# EAGLE schematic PowerLineSwtich (EAGLE 8.1.1)

## Sheet 1 of 3
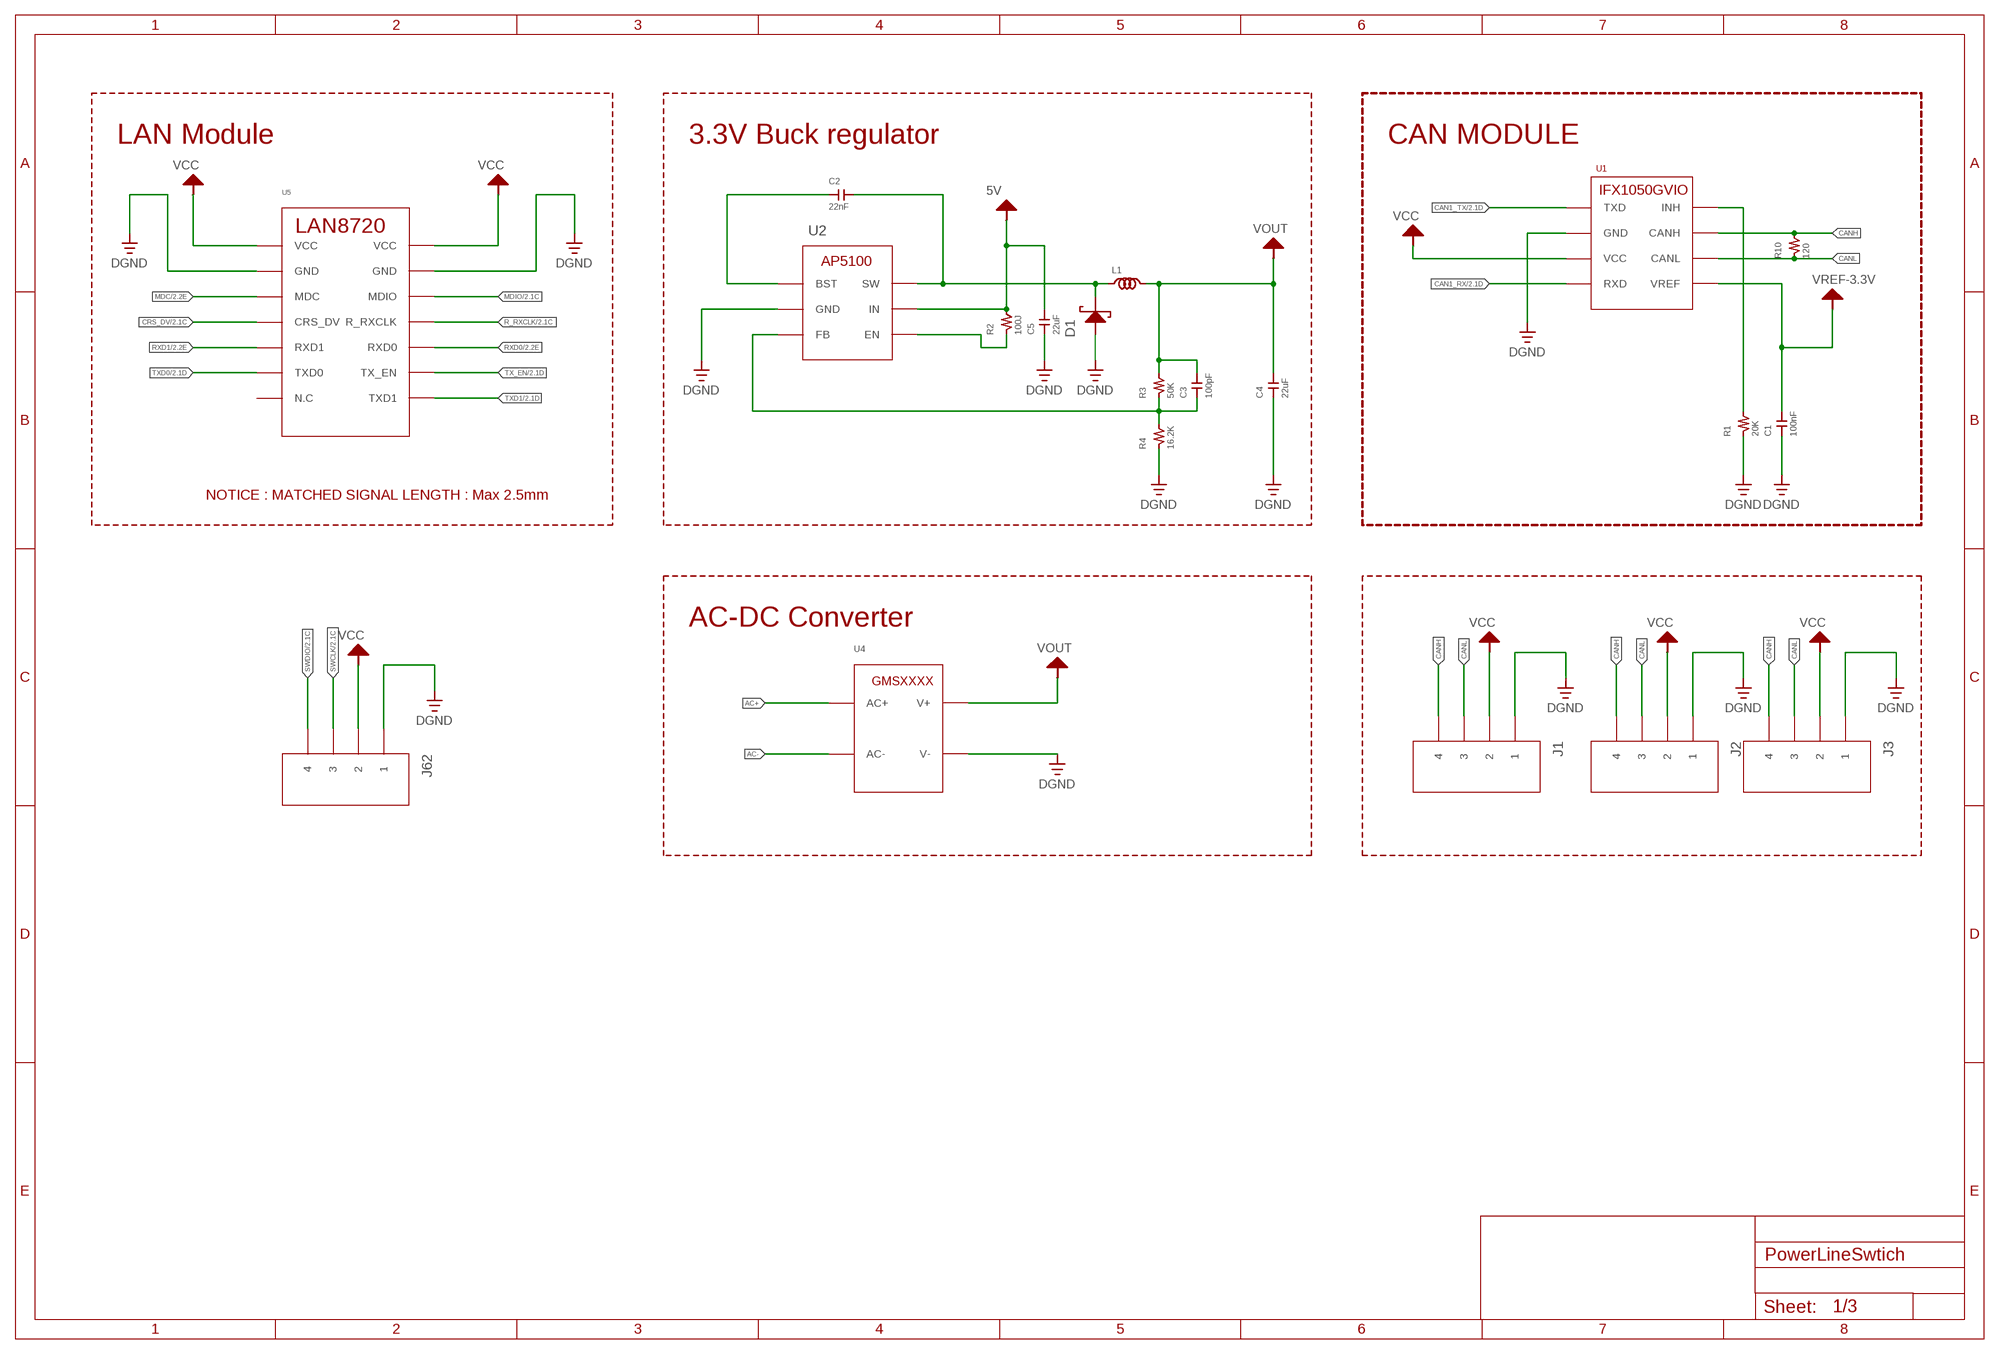
[diagram p0: schematic, sheet 1]

### Parts
C1  100nF  CAPACITOR_CHIP2012  [2012]
C2  22nF  CAPACITOR_CHIP2012  [2012]
C3  100pF  CAPACITOR_CHIP2012  [2012]
C4  22uF  CAPACITOR_CHIP2012  [2012]
C5  22uF  CAPACITOR_CHIP2012  [2012]
D1  BAT60JFILM  [SOD323]
J1  4PIN_2.54  [4PIN]
J2  4PIN_2.54  [4PIN]
J3  4PIN_2.54  [4PIN]
J62  4PIN_2.54  [4PIN]
L1  INDUCTOR2012  [2012]
R1  20K  RESISTOR_CHIP_2012  [2012]
R2  100J  RESISTOR_CHIP_2012  [2012]
R3  50K  RESISTOR_CHIP_2012  [2012]
R4  16.2K  RESISTOR_CHIP_2012  [2012]
R10  120  RESISTOR_CHIP_2012  [2012]
U1  IFX1050GVIO  [PG-DSO-8]
U2  AP5100  [SOT-26]
U4  GMSXXXX  [GMSXXXX]
U5  LAN8720  [7X2]

### Nets
5V: C5.P$2 R2.P$2 U2.P5(IN) U4.P4(V+) ; supply symbol labelled VOUT
AC+: U4.P1(AC+)
AC-: U4.P2(AC-)
BST: C2.P$1 U2.P1(BST)
CAN1_RX: U1.P4(RXD) ; also sheet 2
CAN1_TX: U1.P1(TXD) ; also sheet 2
CANH: J1.P$4 J2.P$4 J3.P$4 R10.P$2 U1.P7(CANH)
CANL: J1.P$3 J2.P$3 J3.P$3 R10.P$1 U1.P6(CANL)
CRS_DV: U5.P7(CRS_DV) ; also sheet 2
DGND: C1.P$1 C4.P$1 C5.P$1 D1.A J1.P$1 J2.P$1 J3.P$1 J62.P$1 R1.P$1 R4.P$1 U1.P2(GND) U2.P2(GND) U4.P3(V-) U5.P3(GND) U5.P4(GND) ; also sheet 2,3
EN: R2.P$1 U2.P4(EN)
FB: C3.P$1 R3.P$1 R4.P$2 U2.P3(FB)
MDC: U5.P5(MDC) ; also sheet 2
MDIO: U5.P6(MDIO) ; also sheet 2
N$3: R1.P$2 U1.P8(INH)
R_RXCLK: U5.P8(R_RXCLK) ; also sheet 2
RXD0: U5.P10(RXD0) ; also sheet 2
RXD1: U5.P9(RXD1) ; also sheet 2
SW: C2.P$2 D1.K L1.P$1 U2.P6(SW)
SWCLK: J62.P$3 ; also sheet 2
SWDIO: J62.P$4 ; also sheet 2
TX_EN: U5.P12(TX_EN) ; also sheet 2
TXD0: U5.P11(TXD0) ; also sheet 2
TXD1: U5.P14(TXD1) ; also sheet 2
VCC: C1.P$2 J1.P$2 J2.P$2 J3.P$2 J62.P$2 U1.P3(VCC) U1.P5(VREF) U5.P1(VCC) U5.P2(VCC) ; supply symbol labelled VREF-3.3V ; also sheet 2
VOUT: C3.P$2 C4.P$2 L1.P$2 R3.P$2
Unconnected: U5.P13(N.C)

### Notes on the sheet
- LAN Module | 3.3V Buck regulator | CAN MODULE
- NOTICE : MATCHED SIGNAL LENGTH : Max 2.5mm
- AC-DC Converter

## Sheet 2 of 3
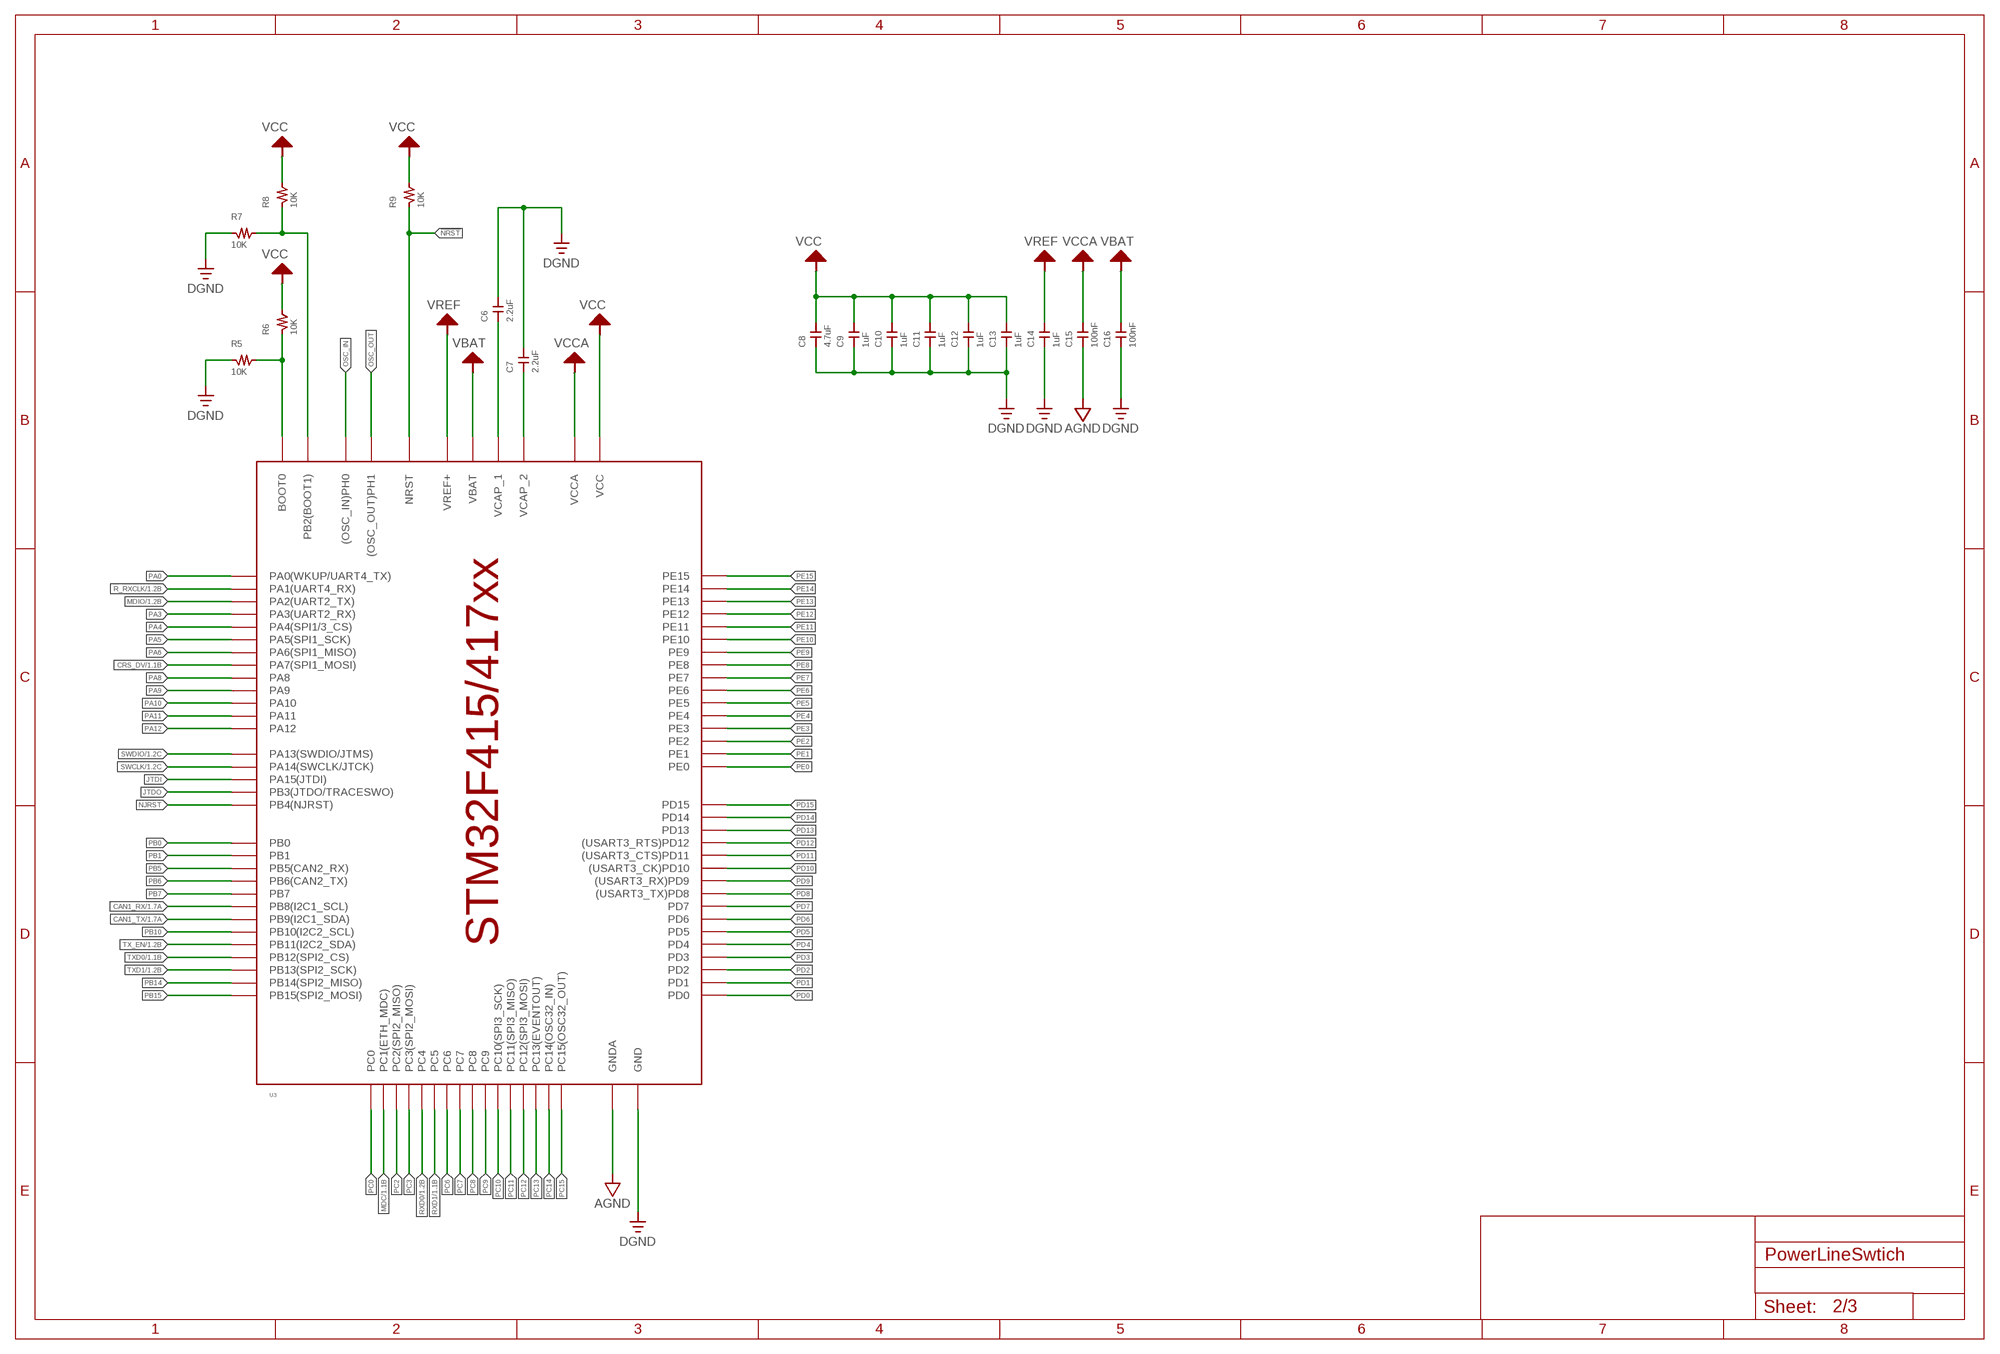
[diagram p1: schematic, sheet 2]

### Parts
C6  2.2uF  CAPACITOR_CHIP2012  [2012]
C7  2.2uF  CAPACITOR_CHIP2012  [2012]
C8  4.7uF  CAPACITOR_CHIP2012  [2012]
C9  1uF  CAPACITOR_CHIP2012  [2012]
C10  1uF  CAPACITOR_CHIP2012  [2012]
C11  1uF  CAPACITOR_CHIP2012  [2012]
C12  1uF  CAPACITOR_CHIP2012  [2012]
C13  1uF  CAPACITOR_CHIP2012  [2012]
C14  1uF  CAPACITOR_CHIP2012  [2012]
C15  100nF  CAPACITOR_CHIP2012  [2012]
C16  100nF  CAPACITOR_CHIP2012  [2012]
R5  10K  RESISTOR_CHIP_2012  [2012]
R6  10K  RESISTOR_CHIP_2012  [2012]
R7  10K  RESISTOR_CHIP_2012  [2012]
R8  10K  RESISTOR_CHIP_2012  [2012]
R9  10K  RESISTOR_CHIP_2012  [2012]
U3  STM32F415/417  [LQFP100]

### Nets
!NRST: R9.P$1 U3.P$14(NRST)
BOOT0: R5.P$2 R6.P$1 U3.P$94(BOOT0)
BOOT1: R7.P$2 R8.P$1 U3.P$37(PB2(BOOT1))
CAN1_RX: U3.P$95(PB8(I2C1_SCL)) ; also sheet 1
CAN1_TX: U3.P$96(PB9(I2C1_SDA)) ; also sheet 1
CRS_DV: U3.P$32(PA7(SPI1_MOSI)) ; also sheet 1
DGND: C6.P$2 C7.P$2 C8.P$1 C9.P$1 C10.P$1 C11.P$1 C12.P$1 C13.P$1 C14.P$1 C15.P$1 C16.P$1 R5.P$1 R7.P$1 U3.P$10(GND) U3.P$20(GNDA) U3.P$27(GND) U3.P$74(GND) U3.P$99(GND) ; supply symbol labelled AGND ; also sheet 1,3
JTDI: U3.P$77(PA15(JTDI))
JTDO: U3.P$89(PB3(JTDO/TRACESWO))
MDC: U3.P$16(PC1(ETH_MDC)) ; also sheet 1
MDIO: U3.P$25(PA2(UART2_TX)) ; also sheet 1
NJRST: U3.P$90(PB4(NJRST))
OSC_IN: U3.P$12((OSC_IN)PH0)
OSC_OUT: U3.P$13((OSC_OUT)PH1)
PA0: U3.P$23(PA0(WKUP/UART4_TX))
PA3: U3.P$26(PA3(UART2_RX))
PA4: U3.P$29(PA4(SPI1/3_CS))
PA5: U3.P$30(PA5(SPI1_SCK))
PA6: U3.P$31(PA6(SPI1_MISO))
PA8: U3.P$67(PA8)
PA9: U3.P$68(PA9)
PA10: U3.P$69(PA10)
PA11: U3.P$70(PA11)
PA12: U3.P$71(PA12)
PB0: U3.P$35(PB0)
PB1: U3.P$36(PB1)
PB5: U3.P$91(PB5(CAN2_RX))
PB6: U3.P$92(PB6(CAN2_TX))
PB7: U3.P$93(PB7)
PB10: U3.P$47(PB10(I2C2_SCL))
PB14: U3.P$53(PB14(SPI2_MISO))
PB15: U3.P$54(PB15(SPI2_MOSI))
PC0: U3.P$15(PC0)
PC2: U3.P$17(PC2(SPI2_MISO))
PC3: U3.P$18(PC3(SPI2_MOSI))
PC6: U3.P$63(PC6)
PC7: U3.P$64(PC7)
PC8: U3.P$65(PC8)
PC9: U3.P$66(PC9)
PC10: U3.P$78(PC10(SPI3_SCK))
PC11: U3.P$79(PC11(SPI3_MISO))
PC12: U3.P$80(PC12(SPI3_MOSI))
PC13: U3.P$7(PC13(EVENTOUT))
PC14: U3.P$8(PC14(OSC32_IN))
PC15: U3.P$9(PC15(OSC32_OUT))
PD0: U3.P$81(PD0)
PD1: U3.P$82(PD1)
PD2: U3.P$83(PD2)
PD3: U3.P$84(PD3)
PD4: U3.P$85(PD4)
PD5: U3.P$86(PD5)
PD6: U3.P$87(PD6)
PD7: U3.P$88(PD7)
PD8: U3.P$55((USART3_TX)PD8)
PD9: U3.P$56((USART3_RX)PD9)
PD10: U3.P$57((USART3_CK)PD10)
PD11: U3.P$58((USART3_CTS)PD11)
PD12: U3.P$59((USART3_RTS)PD12)
PD13: U3.P$60(PD13)
PD14: U3.P$61(PD14)
PD15: U3.P$62(PD15)
PE0: U3.P$97(PE0)
PE1: U3.P$98(PE1)
PE2: U3.P$1(PE2)
PE3: U3.P$2(PE3)
PE4: U3.P$3(PE4)
PE5: U3.P$4(PE5)
PE6: U3.P$5(PE6)
PE7: U3.P$38(PE7)
PE8: U3.P$39(PE8)
PE9: U3.P$40(PE9)
PE10: U3.P$41(PE10)
PE11: U3.P$42(PE11)
PE12: U3.P$43(PE12)
PE13: U3.P$44(PE13)
PE14: U3.P$45(PE14)
PE15: U3.P$46(PE15)
R_RXCLK: U3.P$24(PA1(UART4_RX)) ; also sheet 1
RXD0: U3.P$33(PC4) ; also sheet 1
RXD1: U3.P$34(PC5) ; also sheet 1
SWCLK: U3.P$76(PA14(SWCLK/JTCK)) ; also sheet 1
SWDIO: U3.P$72(PA13(SWDIO/JTMS)) ; also sheet 1
TX_EN: U3.P$48(PB11(I2C2_SDA)) ; also sheet 1
TXD0: U3.P$51(PB12(SPI2_CS)) ; also sheet 1
TXD1: U3.P$52(PB13(SPI2_SCK)) ; also sheet 1
VBAT: C16.P$2 U3.P$6(VBAT)
VCAP1: C6.P$1 U3.P$49(VCAP_1)
VCAP2: C7.P$1 U3.P$73(VCAP_2)
VCC: C8.P$2 C9.P$2 C10.P$2 C11.P$2 C12.P$2 C13.P$2 C15.P$2 R6.P$2 R8.P$2 R9.P$2 U3.P$11(VCC) U3.P$19(VCC) U3.P$22(VCCA) U3.P$28(VCC) U3.P$50(VCC) U3.P$75(VCC) U3.P$100(VCC) ; supply symbol labelled VCCA ; also sheet 1
VREF: C14.P$2 U3.P$21(VREF+)

## Sheet 3 of 3
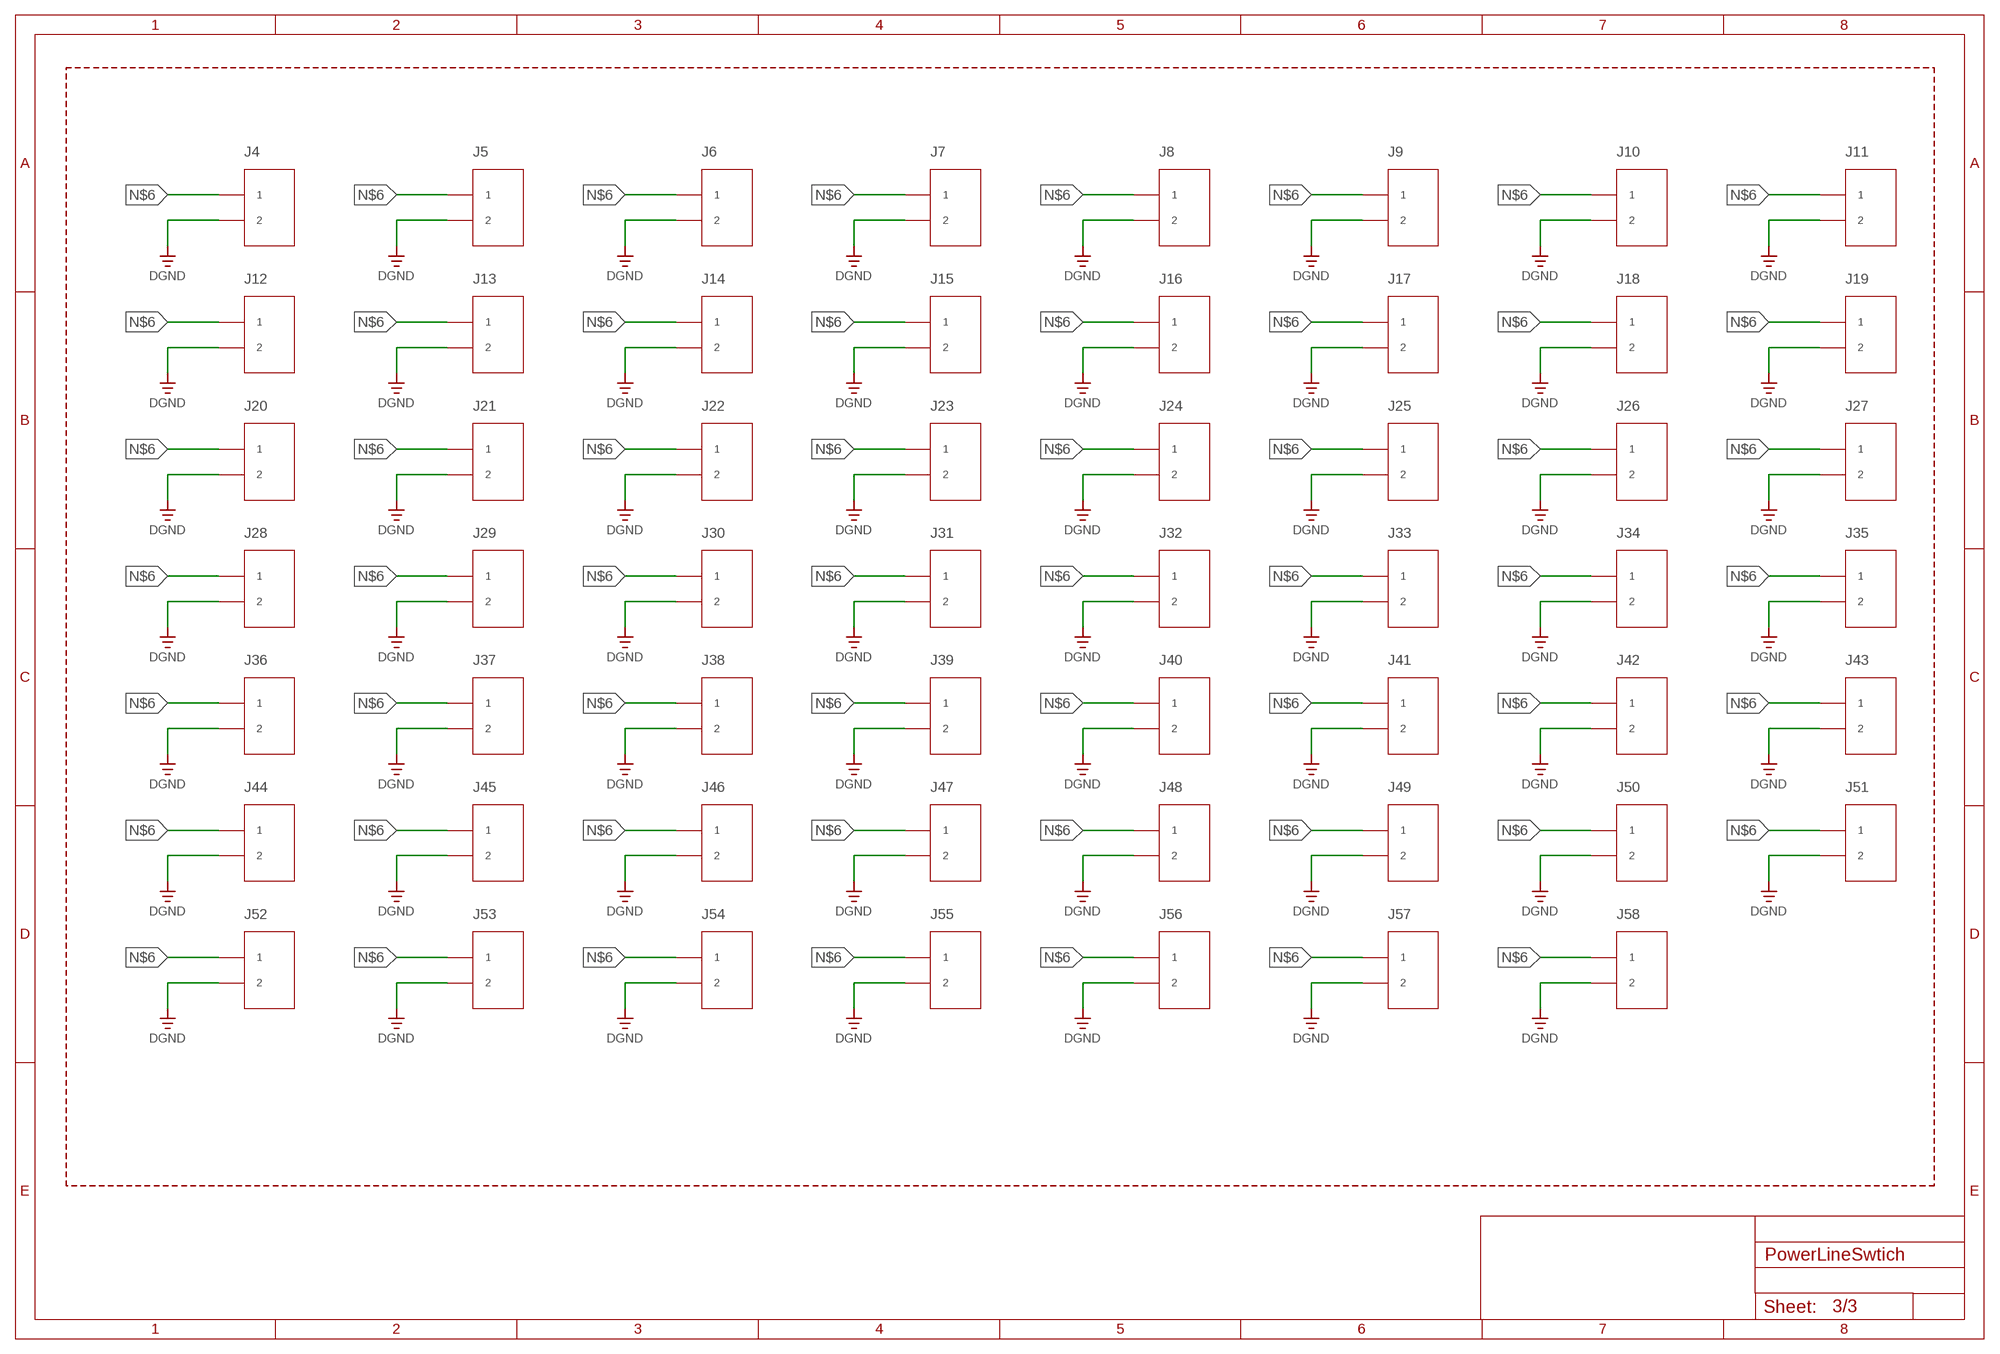
[diagram p2: schematic, sheet 3]

### Parts
J4  2PIN  [2PIN]
J5  2PIN  [2PIN]
J6  2PIN  [2PIN]
J7  2PIN  [2PIN]
J8  2PIN  [2PIN]
J9  2PIN  [2PIN]
J10  2PIN  [2PIN]
J11  2PIN  [2PIN]
J12  2PIN  [2PIN]
J13  2PIN  [2PIN]
J14  2PIN  [2PIN]
J15  2PIN  [2PIN]
J16  2PIN  [2PIN]
J17  2PIN  [2PIN]
J18  2PIN  [2PIN]
J19  2PIN  [2PIN]
J20  2PIN  [2PIN]
J21  2PIN  [2PIN]
J22  2PIN  [2PIN]
J23  2PIN  [2PIN]
J24  2PIN  [2PIN]
J25  2PIN  [2PIN]
J26  2PIN  [2PIN]
J27  2PIN  [2PIN]
J28  2PIN  [2PIN]
J29  2PIN  [2PIN]
J30  2PIN  [2PIN]
J31  2PIN  [2PIN]
J32  2PIN  [2PIN]
J33  2PIN  [2PIN]
J34  2PIN  [2PIN]
J35  2PIN  [2PIN]
J36  2PIN  [2PIN]
J37  2PIN  [2PIN]
J38  2PIN  [2PIN]
J39  2PIN  [2PIN]
J40  2PIN  [2PIN]
J41  2PIN  [2PIN]
J42  2PIN  [2PIN]
J43  2PIN  [2PIN]
J44  2PIN  [2PIN]
J45  2PIN  [2PIN]
J46  2PIN  [2PIN]
J47  2PIN  [2PIN]
J48  2PIN  [2PIN]
J49  2PIN  [2PIN]
J50  2PIN  [2PIN]
J51  2PIN  [2PIN]
J52  2PIN  [2PIN]
J53  2PIN  [2PIN]
J54  2PIN  [2PIN]
J55  2PIN  [2PIN]
J56  2PIN  [2PIN]
J57  2PIN  [2PIN]
J58  2PIN  [2PIN]

### Nets
DGND: J4.P$2 J5.P$2 J6.P$2 J7.P$2 J8.P$2 J9.P$2 J10.P$2 J11.P$2 J12.P$2 J13.P$2 J14.P$2 J15.P$2 J16.P$2 J17.P$2 J18.P$2 J19.P$2 J20.P$2 J21.P$2 J22.P$2 J23.P$2 J24.P$2 J25.P$2 J26.P$2 J27.P$2 J28.P$2 J29.P$2 J30.P$2 J31.P$2 J32.P$2 J33.P$2 J34.P$2 J35.P$2 J36.P$2 J37.P$2 J38.P$2 J39.P$2 J40.P$2 J41.P$2 J42.P$2 J43.P$2 J44.P$2 J45.P$2 J46.P$2 J47.P$2 J48.P$2 J49.P$2 J50.P$2 J51.P$2 J52.P$2 J53.P$2 J54.P$2 J55.P$2 J56.P$2 J57.P$2 J58.P$2 ; also sheet 1,2
N$6: J4.P$1 J5.P$1 J6.P$1 J7.P$1 J8.P$1 J9.P$1 J10.P$1 J11.P$1 J12.P$1 J13.P$1 J14.P$1 J15.P$1 J16.P$1 J17.P$1 J18.P$1 J19.P$1 J20.P$1 J21.P$1 J22.P$1 J23.P$1 J24.P$1 J25.P$1 J26.P$1 J27.P$1 J28.P$1 J29.P$1 J30.P$1 J31.P$1 J32.P$1 J33.P$1 J34.P$1 J35.P$1 J36.P$1 J37.P$1 J38.P$1 J39.P$1 J40.P$1 J41.P$1 J42.P$1 J43.P$1 J44.P$1 J45.P$1 J46.P$1 J47.P$1 J48.P$1 J49.P$1 J50.P$1 J51.P$1 J52.P$1 J53.P$1 J54.P$1 J55.P$1 J56.P$1 J57.P$1 J58.P$1

## Library data of the parts
C1-C16 = passive:CAPACITOR_CHIP
D1 = Diode:BAT60: BAT60 is Schottky barrier diode encapsulated in a SOD-323 small SMD package. This device is intended for use in portable equipments. It is suited for DC to DC converters, step-up conversion and power management.
J1-J3 J62 = connector:4PIN: 2.54mm pitch 4x1 pin Connector (Available as Headers or Pins)
J4-J58 = connector:2PIN
L1 = passive:INDUCTOR
R1-R10 = passive:RESISTOR_CHIP_
U1 = CAN:IFX1050GVIO: The HS CAN-transceiver IFX1050GVIO is optimized for high speed differential mode data transmission in industrial applications and is compatible to ISO/DIS 11898. It works as an interface between the CAN protocol controller and the physical differential bus in both, 12 V and 24 V systems. The IFX1050GVIO is designed to withstand the conditions of industrial applications and provides excellent EMC performance.
U2 = Regulator:AP5100: The AP5100 is a current mode step-down converter with a built-in power MOSFET to enable smallest solution size power conversion. With the low series resistance power switch it enables a constant output current of up to 1.2A over a wide input supply range. The load and line regulation has excellent response time over the operating input voltage and temperature range. The AP5100 is self protected, through a cycle-by-cycle current limiting algorithm and an on chip thermal protection. The AP5100 will provide the voltage conversion with a low count of widely available standard external components. The AP5100 is available in SOT26 package.
U3 = ST-MCU:STM32F415/417
U4 = ACDC:GMSXXXX
U5 = LAN:LAN8720